# Altium schematic sheet 十六路输出.SchDoc: 阿波罗十六路输出控制器
size A4; Revision: V1.0; SheetNumber: 0; SheetTotal: 0
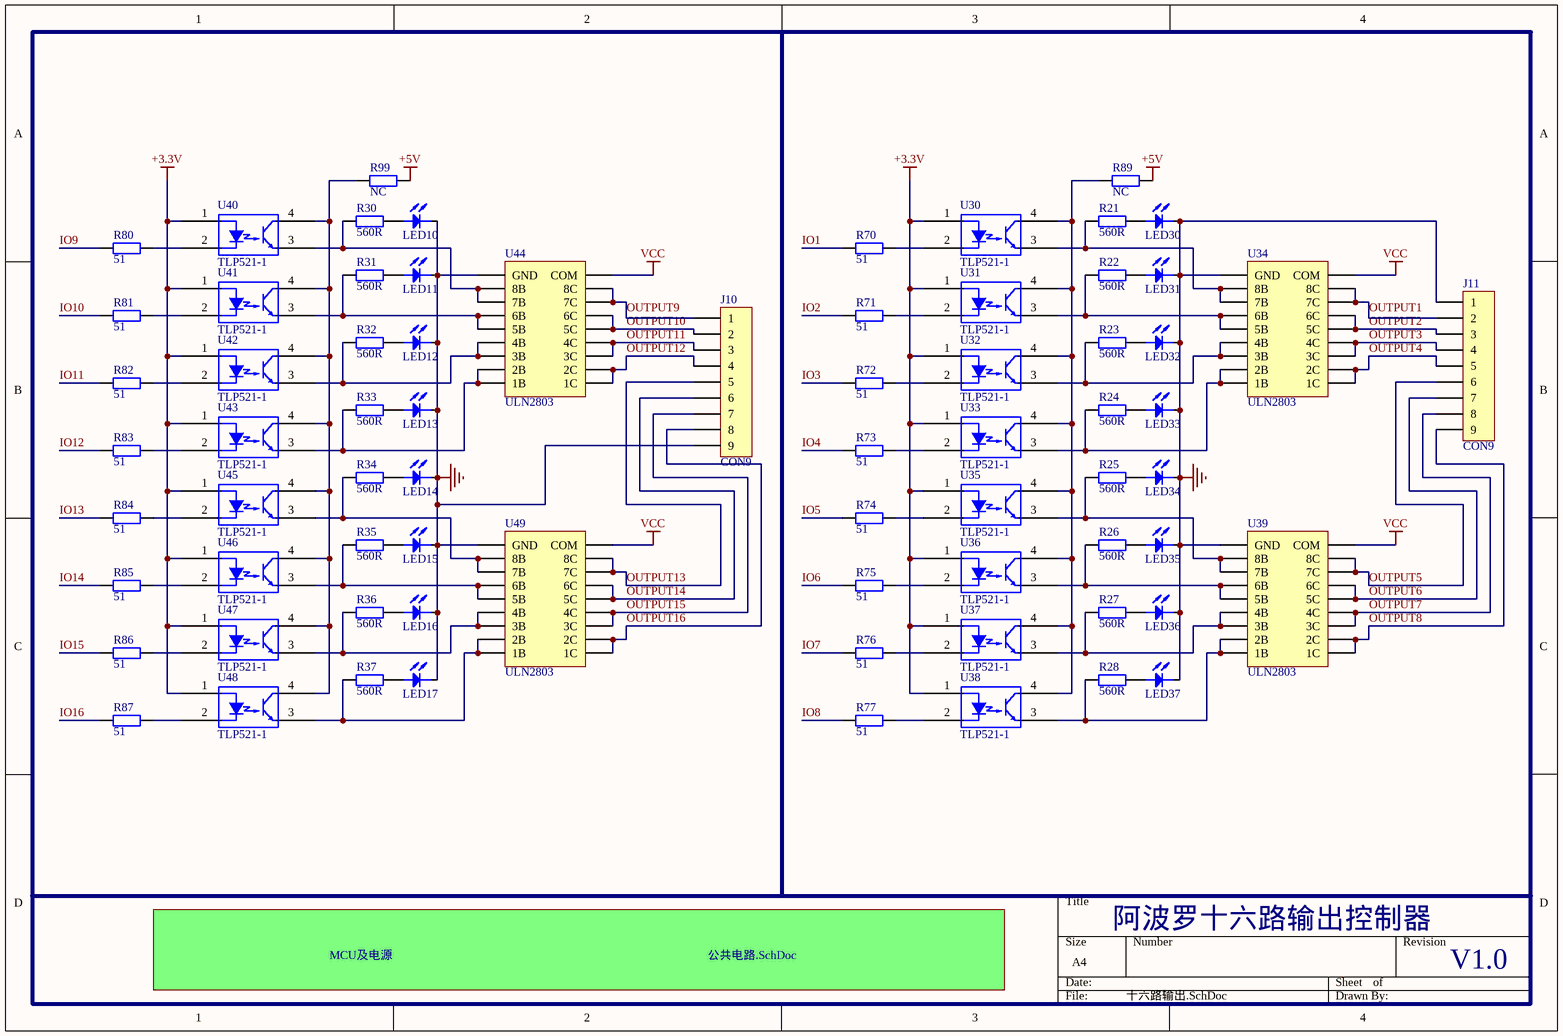
[diagram p0: 十六路输出.SchDoc]

## Parts
J10  CON9  [CON9*5.1]
J11  CON9  [CON9*5.1]
LED10  LED  [LED2.5]  (value not drawn)
LED11  LED  [LED2.5]  (value not drawn)
LED12  LED  [LED2.5]  (value not drawn)
LED13  LED  [LED2.5]  (value not drawn)
LED14  LED  [LED2.5]  (value not drawn)
LED15  LED  [LED2.5]  (value not drawn)
LED16  LED  [LED2.5]  (value not drawn)
LED17  LED  [LED2.5]  (value not drawn)
LED30  LED  [LED2.5]  (value not drawn)
LED31  LED  [LED2.5]  (value not drawn)
LED32  LED  [LED2.5]  (value not drawn)
LED33  LED  [LED2.5]  (value not drawn)
LED34  LED  [LED2.5]  (value not drawn)
LED35  LED  [LED2.5]  (value not drawn)
LED36  LED  [LED2.5]  (value not drawn)
LED37  LED  [LED2.5]  (value not drawn)
R21  560R  [0603A]
R22  560R  [0603A]
R23  560R  [0603A]
R24  560R  [0603A]
R25  560R  [0603A]
R26  560R  [0603A]
R27  560R  [0603A]
R28  560R  [0603A]
R30  560R  [0603A]
R31  560R  [0603A]
R32  560R  [0603A]
R33  560R  [0603A]
R34  560R  [0603A]
R35  560R  [0603A]
R36  560R  [0603A]
R37  560R  [0603A]
R70  51  [0603A]
R71  51  [0603A]
R72  51  [0603A]
R73  51  [0603A]
R74  51  [0603A]
R75  51  [0603A]
R76  51  [0603A]
R77  51  [0603A]
R80  51  [0603A]
R81  51  [0603A]
R82  51  [0603A]
R83  51  [0603A]
R84  51  [0603A]
R85  51  [0603A]
R86  51  [0603A]
R87  51  [0603A]
R89  NC  [0603A]
R99  NC  [0603A]
U30  TLP521-1  [PC817]
U31  TLP521-1  [PC817]
U32  TLP521-1  [PC817]
U33  TLP521-1  [PC817]
U34  ULN2803  [sol18]
U35  TLP521-1  [PC817]
U36  TLP521-1  [PC817]
U37  TLP521-1  [PC817]
U38  TLP521-1  [PC817]
U39  ULN2803  [sol18]
U40  TLP521-1  [PC817]
U41  TLP521-1  [PC817]
U42  TLP521-1  [PC817]
U43  TLP521-1  [PC817]
U44  ULN2803  [sol18]
U45  TLP521-1  [PC817]
U46  TLP521-1  [PC817]
U47  TLP521-1  [PC817]
U48  TLP521-1  [PC817]
U49  ULN2803  [sol18]

## Sub-sheets
MCU及电源 = 公共电路.SchDoc: no entries

## Nets
+3.3V: U30.1(ANODE) U31.1(ANODE) U32.1(ANODE) U33.1(ANODE) U35.1(ANODE) U36.1(ANODE) U37.1(ANODE) U38.1(ANODE) U40.1(ANODE) U41.1(ANODE) U42.1(ANODE) U43.1(ANODE) U45.1(ANODE) U46.1(ANODE) U47.1(ANODE) U48.1(ANODE)
+5V: R89.2 R99.2
GND: J10.9 J11.1 LED10.K LED11.K LED12.K LED13.K LED14.K LED15.K LED16.K LED17.K LED30.K LED31.K LED32.K LED33.K LED34.K LED35.K LED36.K LED37.K U34.9(GND) U39.9(GND) U44.9(GND) U49.9(GND)
VCC: U34.10(COM) U39.10(COM) U44.10(COM) U49.10(COM)
IO1: R70.1
IO2: R71.1
IO3: R72.1
IO4: R73.1
IO5: R74.1
IO6: R75.1
IO7: R76.1
IO8: R77.1
IO9: R80.1
IO10: R81.1
IO11: R82.1
IO12: R83.1
IO13: R84.1
IO14: R85.1
IO15: R86.1
IO16: R87.1
OUTPUT1: J11.2 U34.11(8C) U34.12(7C)
OUTPUT2: J11.3 U34.13(6C) U34.14(5C)
OUTPUT3: J11.4 U34.15(4C) U34.16(3C)
OUTPUT4: J11.5 U34.17(2C) U34.18(1C)
OUTPUT5: J11.6 U39.11(8C) U39.12(7C)
OUTPUT6: J11.7 U39.13(6C) U39.14(5C)
OUTPUT7: J11.8 U39.15(4C) U39.16(3C)
OUTPUT8: J11.9 U39.17(2C) U39.18(1C)
OUTPUT9: J10.1 U44.11(8C) U44.12(7C)
OUTPUT10: J10.2 U44.13(6C) U44.14(5C)
OUTPUT11: J10.3 U44.15(4C) U44.16(3C)
OUTPUT12: J10.4 U44.17(2C) U44.18(1C)
OUTPUT13: J10.5 U49.11(8C) U49.12(7C)
OUTPUT14: J10.6 U49.13(6C) U49.14(5C)
OUTPUT15: J10.7 U49.15(4C) U49.16(3C)
OUTPUT16: J10.8 U49.17(2C) U49.18(1C)
NetLED10_A: LED10.A R30.2
NetLED11_A: LED11.A R31.2
NetLED12_A: LED12.A R32.2
NetLED13_A: LED13.A R33.2
NetLED14_A: LED14.A R34.2
NetLED15_A: LED15.A R35.2
NetLED16_A: LED16.A R36.2
NetLED17_A: LED17.A R37.2
NetLED30_A: LED30.A R21.2
NetLED31_A: LED31.A R22.2
NetLED32_A: LED32.A R23.2
NetLED33_A: LED33.A R24.2
NetLED34_A: LED34.A R25.2
NetLED35_A: LED35.A R26.2
NetLED36_A: LED36.A R27.2
NetLED37_A: LED37.A R28.2
NetR21_1: R21.1 U30.3(EMIT) U34.7(7B) U34.8(8B)
NetR22_1: R22.1 U31.3(EMIT) U34.5(5B) U34.6(6B)
NetR23_1: R23.1 U32.3(EMIT) U34.3(3B) U34.4(4B)
NetR24_1: R24.1 U33.3(EMIT) U34.1(1B) U34.2(2B)
NetR25_1: R25.1 U35.3(EMIT) U39.7(7B) U39.8(8B)
NetR26_1: R26.1 U36.3(EMIT) U39.5(5B) U39.6(6B)
NetR27_1: R27.1 U37.3(EMIT) U39.3(3B) U39.4(4B)
NetR28_1: R28.1 U38.3(EMIT) U39.1(1B) U39.2(2B)
NetR30_1: R30.1 U40.3(EMIT) U44.7(7B) U44.8(8B)
NetR31_1: R31.1 U41.3(EMIT) U44.5(5B) U44.6(6B)
NetR32_1: R32.1 U42.3(EMIT) U44.3(3B) U44.4(4B)
NetR33_1: R33.1 U43.3(EMIT) U44.1(1B) U44.2(2B)
NetR34_1: R34.1 U45.3(EMIT) U49.7(7B) U49.8(8B)
NetR35_1: R35.1 U46.3(EMIT) U49.5(5B) U49.6(6B)
NetR36_1: R36.1 U47.3(EMIT) U49.3(3B) U49.4(4B)
NetR37_1: R37.1 U48.3(EMIT) U49.1(1B) U49.2(2B)
NetR70_2: R70.2 U30.2(CATH)
NetR71_2: R71.2 U31.2(CATH)
NetR72_2: R72.2 U32.2(CATH)
NetR73_2: R73.2 U33.2(CATH)
NetR74_2: R74.2 U35.2(CATH)
NetR75_2: R75.2 U36.2(CATH)
NetR76_2: R76.2 U37.2(CATH)
NetR77_2: R77.2 U38.2(CATH)
NetR80_2: R80.2 U40.2(CATH)
NetR81_2: R81.2 U41.2(CATH)
NetR82_2: R82.2 U42.2(CATH)
NetR83_2: R83.2 U43.2(CATH)
NetR84_2: R84.2 U45.2(CATH)
NetR85_2: R85.2 U46.2(CATH)
NetR86_2: R86.2 U47.2(CATH)
NetR87_2: R87.2 U48.2(CATH)
NetR89_1: R89.1 U30.4(COL) U31.4(COL) U32.4(COL) U33.4(COL) U35.4(COL) U36.4(COL) U37.4(COL) U38.4(COL)
NetR99_1: R99.1 U40.4(COL) U41.4(COL) U42.4(COL) U43.4(COL) U45.4(COL) U46.4(COL) U47.4(COL) U48.4(COL)

## Library data of the parts
R21-R28 R30-R37 R70-R77 R80-R87 R89 R99 = Res2: Resistor; Value: 1K; Published: 8-Jun-2000; LatestRevisionDate: 17-Jul-2002; LatestRevisionNote: Re-released for DXP Platform.; PackageReference: AXIAL-0.4; Publisher: Altium Limited
U30-U33 U35-U38 U40-U43 U45-U48 = TLP521-1: Single NPN PhotoTransistor OptoCoupler.